# Altium schematic sheet Main.SchDoc
size A4; SheetNumber: 1; SheetTotal: 1; SPICEModelCacheBLOYWJUL: <root> / <DocumentId>BLOYWJUL</DocumentId> / <CacheFrame Number="0"> / <Model Name="0603_885012006004_22pf" Kind="CKT"> / <Text>******* / .subckt 0603_885012006004_22pF 1 2 / Rser 1 3 0.34819611654 / Lser 2 4 7.75018519E-10 / C1 3 4 0.000000000022 / Rpar 3 4 10000000000 / .ends 0603_885012006004_22pF</Text> / </Model> / <Model Name="0603_885382206004_100nf" Kind="CKT"> / <Text>******* / .subckt 0603_885382206004_100nF 1 2 / Rser 1 3 0.105 / Lser 2 4 7.84352286E-10 / C1 3 4 0.0000001 / Rpar 3 4 5000000000 / .ends 0603_885382206004_100nF</Text> / </Model> / <Model Name="0603_885382206002_10nf" Kind="CKT"> / <Text>******* / .subckt 0603_885382206002_10nF 1 2 / Rser 1 3 0.19 / Lser 2 4 8.43227742E-10 / C1 3 4 0.00000001 / Rpar 3 4 10000000000 / .ends 0603_885382206002_10nF</Text> / </Model> / </CacheFrame> / </root>
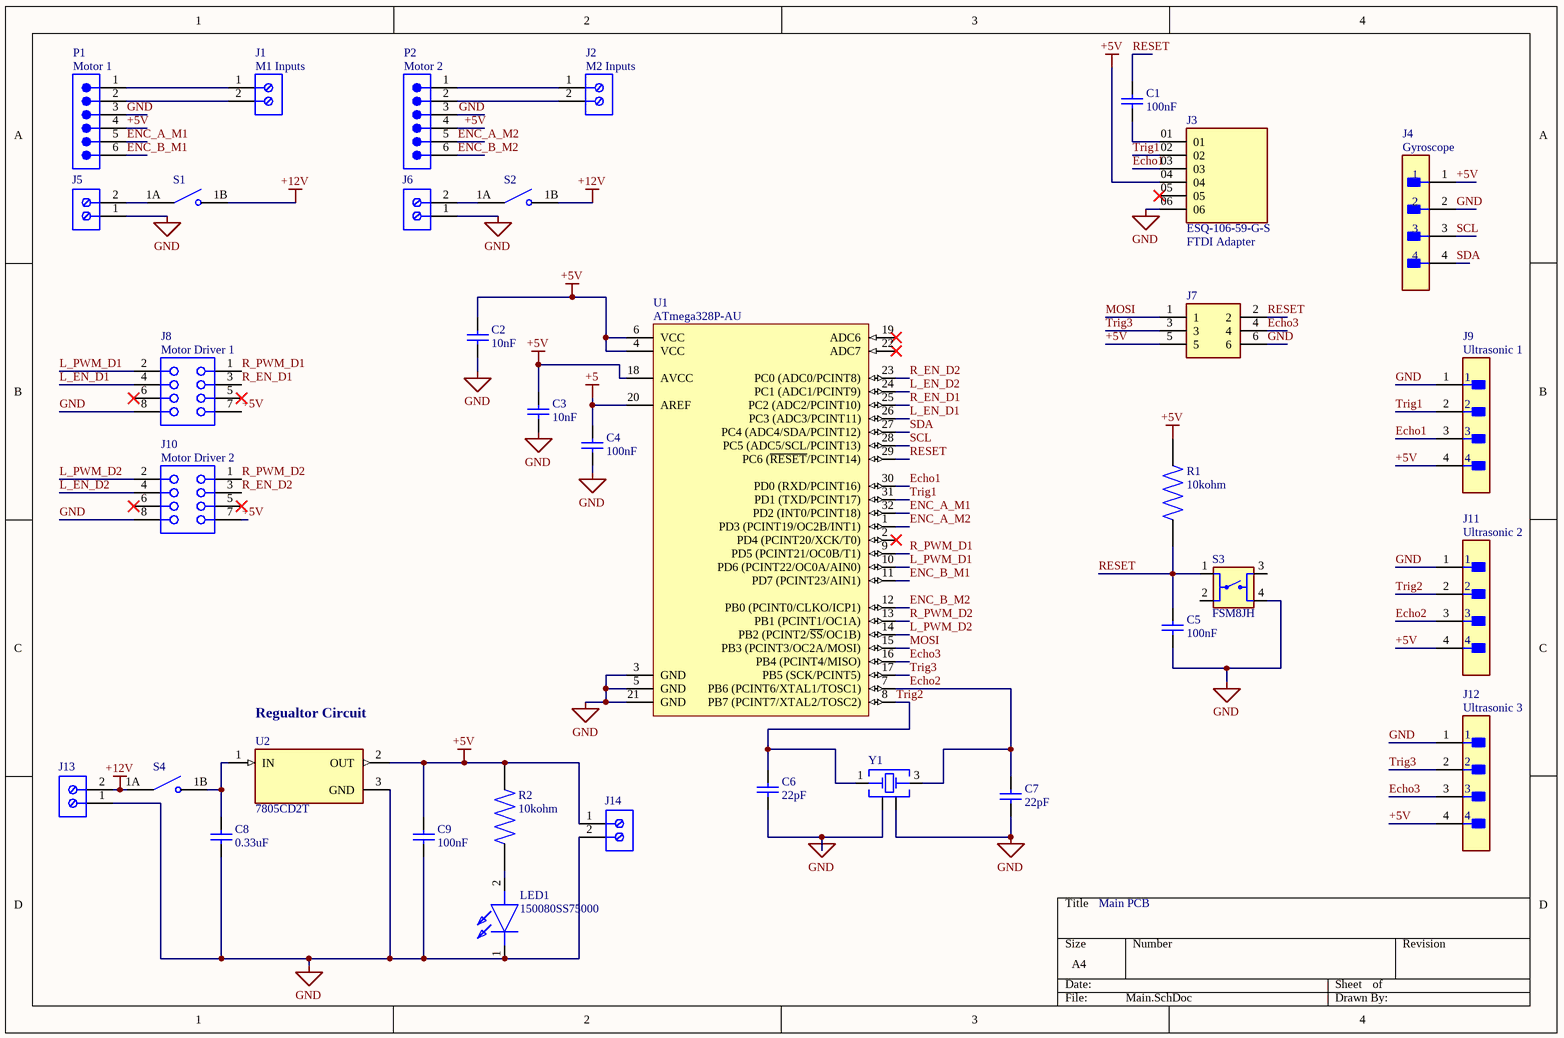
[diagram p0: Main.SchDoc]

## Parts
C1  100nF  [WCAP-CSST_0603_L1.6W0.8H0.8_Reflow]
C2  10nF  [WCAP-CSST_0603_L1.6W0.8H0.8_Reflow]
C3  10nF  [WCAP-CSST_0603_L1.6W0.8H0.8_Reflow]
C4  100nF  [WCAP-CSST_0603_L1.6W0.8H0.8_Reflow]
C5  100nF  [WCAP-CSST_0603_L1.6W0.8H0.8_Reflow]
C6  22pF  [WCAP-CSGP_0603_L1.6W0.8H0.8_Reflow]
C7  22pF  [WCAP-CSGP_0603_L1.6W0.8H0.8_Reflow]
C8  Capacitance: 0.33uF  [WCAP-CSST_0603_L1.6W0.8H0.8_Reflow]  (hidden comment: 100nF)
C9  100nF  [WCAP-CSST_0603_L1.6W0.8H0.8_Reflow]
J1  691137710002  [691137710002]  (value not drawn)
J2  691137710002  [691137710002]  (value not drawn)
J3  ESQ-106-59-G-S  [SAMTEC_ESQ-106-59-G-S]
J4  MPU6050  [FP-M20-9990445-MFG]  (value not drawn)
J5  691137710002  [691137710002]  (value not drawn)
J6  691137710002  [691137710002]  (value not drawn)
J7  20021111-00006T4LF  [2002111100006T4LF]  (value not drawn)
J8  Motor Driver 1  [SMTC-SSW-104-02-X-D]
J9  Ultrasonic 1  [FP-B4B-XH-A_LF_SN-MFG]
J10  Motor Driver 2  [SMTC-SSW-104-02-X-D]
J11  Ultrasonic 2  [FP-B4B-XH-A_LF_SN-MFG]
J12  Ultrasonic 3  [FP-B4B-XH-A_LF_SN-MFG]
J13  691137710002  [691137710002]  (value not drawn)
J14  691137710002  [691137710002]  (value not drawn)
LED1  150080SS75000  [150080SS75000]
P1  Motor 1  [61300611121]
P2  Motor 2  [61300611121]
R1  value 10kohm  [RESC2012X65N]  (hidden comment: RMCF0805FG10K0)
R2  value 10kohm  [RESC2012X65N]  (hidden comment: RMCF0805FG10K0)
S1  DS01-254-L-01BE  [SW_DS01-254-L-01BE]  (value not drawn)
S2  DS01-254-L-01BE  [SW_DS01-254-L-01BE]  (value not drawn)
S3  FSM8JH  [SW_FSM8JH]
S4  DS01-254-L-01BE  [SW_DS01-254-L-01BE]  (value not drawn)
U1  ATmega328P-AU  [32A_M]
U2  7805CD2T  [TO254P1542X460-3N]
Y1  830072604  [WE-XTAL_CFPX-180]  (value not drawn)

## Nets
+5: C4.2 U1.20(AREF)
+5V: C2.2 C3.2 C9.2 J3.04 J4.1 J7.5 J8.7 J9.4 J10.7 J11.4 J12.4 J14.1 P1.4 P2.4 R1.2 R2.2 U1.4(VCC) U1.6(VCC) U1.18(AVCC) U2.2(OUT)
+12V: J13.2 S1.1B(NO1) S2.1B(NO1) S4.1A(COM1)
GND: C2.1 C3.1 C4.1 C5.1 C6.1 C7.1 C8.1 C9.1 J3.06 J4.2 J5.1 J6.1 J7.6 J8.8 J9.1 J10.8 J11.1 J12.1 J13.1 J14.2 LED1.1(K) P1.3 P2.3 S3.4 U1.3(GND) U1.5(GND) U1.21(GND) U2.3(GND) Y1.2(GND&Lid) Y1.4(GND&Lid)
Echo1: J3.03 J9.3 U1.30(PD0_(RXD/PCINT16))
Echo2: C7.2 J11.3 U1.7(PB6_(PCINT6/XTAL1/TOSC1)) Y1.3(Crystal)
Echo3: J7.4 J12.3 U1.16(PB4_(PCINT4/MISO))
ENC_A_M1: P1.5 U1.32(PD2_(INT0/PCINT18))
ENC_A_M2: P2.5 U1.1(PD3_(PCINT19/OC2B/INT1))
ENC_B_M1: P1.6 U1.11(PD7_(PCINT23/AIN1))
ENC_B_M2: P2.6 U1.12(PB0_(PCINT0/CLKO/ICP1))
L_EN_D1: J8.4 U1.26(PC3_(ADC3/PCINT11))
L_EN_D2: J10.4 U1.24(PC1_(ADC1/PCINT9))
L_PWM_D1: J8.2 U1.10(PD6_(PCINT22/OC0A/AIN0))
L_PWM_D2: J10.2 U1.14(PB2_(PCINT2/~{SS}/OC1B))
MOSI: J7.1 U1.15(PB3_(PCINT3/OC2A/MOSI))
R_EN_D1: J8.3 U1.25(PC2_(ADC2/PCINT10))
R_EN_D2: J10.3 U1.23(PC0_(ADC0/PCINT8))
R_PWM_D1: J8.1 U1.9(PD5_(PCINT21/OC0B/T1))
R_PWM_D2: J10.1 U1.13(PB1_(PCINT1/OC1A))
RESET: C1.2 C5.2 J7.2 R1.1 S3.1 U1.29(PC6_(~{RESET}/PCINT14))
SCL: J4.3 U1.28(PC5_(ADC5/SCL/PCINT13))
SDA: J4.4 U1.27(PC4_(ADC4/SDA/PCINT12))
Trig1: J3.02 J9.2 U1.31(PD1_(TXD/PCINT17))
Trig2: C6.2 J11.2 U1.8(PB7_(PCINT7/XTAL2/TOSC2)) Y1.1(Crystal)
Trig3: J7.3 J12.2 U1.17(PB5_(SCK/PCINT5))
NetC1_1: C1.1 J3.01
NetC8_2: C8.2 S4.1B(NO1) U2.1(IN)
NetJ1_1: J1.1 P1.1
NetJ1_2: J1.2 P1.2
NetJ2_1: J2.1 P2.1
NetJ2_2: J2.2 P2.2
NetJ5_2: J5.2 S1.1A(COM1)
NetJ6_2: J6.2 S2.1A(COM1)
NetLED1_2: LED1.2(A) R2.1

Not connected (* = marked no-connect by the designer): J3 05*; J8 5* 6*; J10 5* 6*; S3 2 3; U1 2(PD4_(PCINT20/XCK/T0))* 19(ADC6)* 22(ADC7)*

## Notes on the sheet
- (near J1) M1 Inputs
- (near J2) M2 Inputs
- (near J4) Gyroscope
- (near J3) FTDI Adapter
- (near U2) Regualtor Circuit
- Main PCB

## Library data of the parts
C1 C4 C5 C8 C9 = 885382206004: WCAP-CSST Multilayer Ceramic Chip Capacitor, Soft Termination, size 0603, X7R Class II, 100nF, 50VDC; Manufacturer: Wurth Elektronik; Case/Size Code: 0603; Capacitance Tolerance: +/-10%; Dissipation Factor: 3%; Insulation Resistance: 5GOhm; Rated Voltage (DC): 50V; Technical Reference: X7R0603104K050DFCT1S000; Manufacturer Part Number: 885382206004; Category: Multilayer Ceramic Chip Capacitors; Match Code: WCAP-CSST; ComponentLink1Description: Website Link; ComponentLink1URL: https://www.we-online.com/redexpert/article/885382206004?ad; ComponentLink2Description: Datasheet Link; ComponentLink2URL: https://www.we-online.com/redexpert/spec/885382206004?ad; Mount: Surface Mount; Operating Temperature Max: 125°C; Operating Temperature Min: -55°C; Packaging: Tape and Reel; Length: 1.6mm; Width: 0.8mm; Height: 0.8mm; Ceramic Type: X7R Class II
  C1 C4 C5 C9: Capacitance: 100nF
C2 C3 = 885382206002: WCAP-CSST Multilayer Ceramic Chip Capacitor, Soft Termination, size 0603, X7R Class II, 10nF, 50VDC; Manufacturer: Wurth Elektronik; Case/Size Code: 0603; Capacitance Tolerance: +/-10%; Dissipation Factor: 2.5%; Insulation Resistance: 10GOhm; Rated Voltage (DC): 50V; Technical Reference: X7R0603103K050DFCT1S000; Manufacturer Part Number: 885382206002; Category: Multilayer Ceramic Chip Capacitors; Match Code: WCAP-CSST; ComponentLink1Description: Website Link; ComponentLink1URL: https://www.we-online.com/redexpert/article/885382206002?ad; ComponentLink2Description: Datasheet Link; ComponentLink2URL: https://www.we-online.com/redexpert/spec/885382206002?ad; Mount: Surface Mount; Operating Temperature Max: 125°C; Operating Temperature Min: -55°C; Packaging: Tape and Reel; Length: 1.6mm; Width: 0.8mm; Height: 0.8mm; Capacitance: 10nF; Ceramic Type: X7R Class II
C6 C7 = 885012006004: WCAP-CSGP Multilayer Ceramic Chip Capacitor, General Purpose, size 0603, NP0, 22pF, 10VDC; Manufacturer: Wurth Elektronik; Case/Size Code: 0603; Capacitance Tolerance: +/-5%; Insulation Resistance: 10GOhm; Q Factor: 840; Rated Voltage (DC): 10V; Technical Reference: NP00603220J010DFCT10000; Manufacturer Part Number: 885012006004; Category: Multilayer Ceramic Chip Capacitors; Match Code: WCAP-CSGP; ComponentLink1Description: Website Link; ComponentLink1URL: https://www.we-online.com/redexpert/article/885012006004?ad; ComponentLink2Description: Datasheet Link; ComponentLink2URL: https://www.we-online.com/redexpert/spec/885012006004?ad; Mount: Surface Mount; Operating Temperature Max: 125°C; Operating Temperature Min: -55°C; Packaging: Tape and Reel; Length: 1.6mm; Width: 0.8mm; Height: 0.8mm; Capacitance: 22pF; Ceramic Type: NP0
J1 J2 J5 J6 J13 J14 = CMP-1502-03324-2: NexarPartId: 78871135; Voltage Rating: 300V; Number of Contacts: 2; Current Rating: 16A; Lead Pitch: 5mm; Height: 11.6mm; Packaging: Box; RoHS: Non-Compliant; Contact Material: Nickel, Tin; Max Operating Temperature: 120°C; Number of Pins: 2; Min Operating Temperature: -30°C; Number of Rows: 1
J4 = CMP-00671-05399696-1: M20-9990445 Conn Unshrouded Header HDR 4 POS 2.54mm Solder ST Thru-Hole Bulk/Loose; Insulation Resistance: 10GΩ; Connector Type: Male Pin; Voltage Rating (DC): 750V; Max Current Rating: 3A; Contact Resistance: 25mΩ; Number of Contacts: 4; Gender: Male; Color: Black; Height: 2.54mm; Contact Material: Brass, Bronze, Gold, Nickel; Orientation: Straight; Width: 12.7mm; Mount: Through Hole; Pitch: 2.54mm; Lead Pitch: 2.54mm; RoHS: Compliant; Max Operating Temperature: 105°C; Case/Package: SIL; NexarPartId: 5399696; Depth: 2.54mm; Length: 10.16mm; Current Rating: 3A; Contact Plating: Gold; Radiation Hardening: No; Contact Mating Length: 6.096mm; Voltage Rating (AC): 750V; Termination: Solder; REACH SVHC: No SVHC; Weight: 45.359237g; Number of Rows: 1; Min Operating Temperature: -40°C; Housing Material: Nylon; Housing Color: Black; Number of Positions: 4; Number of Pins: 4
J7 = 20021111-00006T4LF: Connector; Manufacturer_Name: Amphenol Communications Solutions; Datasheet Link: https://cdn.amphenol-cs.com/media/wysiwyg/files/drawing/20021111.pdf; Height: 5mm; Manufacturer_Part_Number: 20021111-00006T4LF; Arrow Part Number: 20021111-00006T4LF; Arrow Price/Stock: https://www.arrow.com/en/products/20021111-00006t4lf/amphenol-fci?region=europe
J8 J10 = CMP-1023-00343-1: SQ Post Socket, Through-hole, Vertical, -55 to 125 degC, 2.54mm Pitch, 8-Pin, Female, RoHS; Manufacturer: Samtec; PartNumber: SSW-104-02-G-D; Mounting Technology: Through-hole; ComponentLink1Description: Manufacturer URL; Orientation: Vertical; Pitch: 2.54 mm; ComponentLink2URL: http://www.samtec.com/documents/webfiles/pdf/SSW_TH.PDF; PackageReference: SSW-104-02-X-D; ComponentLink3Description: Package Specification; PackageVersion: CA, 6/1987; PackageDescription: Assembly, Socket Strip .016 X .031 Tail; ComponentLink2Description: Datasheet; RoHS: True; ComponentLink1URL: http://www.samtec.com; ComponentLink3URL: http://www.samtec.com/documents/webfiles/cpdf/SSW-1XX-XX-XXX-X-XX-XXX-XX-MKT.pdf; DatasheetVersion: F-214; Temperature Range: -55 to 125 degC
J9 J11 J12 = CMP-17439-000250-1: CONN HEADER VERT 4POS 2.5MM; Number of Contacts: 4; Contact Resistance: 20mR; Voltage Rating: 250V; Max Current Rating: 3A; Gender: Male; Wire/Cable Gauge: 22AWG; Mated Stacking Heights: 9.8mm; Insulation Resistance: 1GR; Orientation: Straight; Contact Type: Male Pin; Contact Finish - Mating: TIN; Series: XH; Max Voltage Rating (AC): 250V; Lead Pitch: 2.5mm; Contact Shape: Square; Insulation Color: Natural; Termination: Solder; Lead Free: Lead Free; Voltage Rating (AC): 250V; Number of Rows: 1; Flammability Rating: UL94 V-0; Number of Positions: 4; Max Operating Temperature: 85°C; Package Quantity: 500; Mount: Through Hole; REACH SVHC: No SVHC; Connector Type: Header; Insulation Material: Nylon; Fastening Type: Detent; Min Operating Temperature: -25°C; Housing Color: White; Packaging: Bulk; Contact Plating: Tin; Contact Material: Brass; Max Voltage Rating (DC): 250V; Housing Material: Polyamide; Color: Natural; Material: Polyamide; Pitch: 2.5mm; Depth: 5.75mm; Current Rating: 3A; Length: 12.4mm
LED1 = 150080SS75000: LED; Manufacturer_Name: Wurth Elektronik; Datasheet Link: https://www.we-online.com/components/products/datasheet/150080SS75000.pdf; Height: 0.8mm; Manufacturer_Part_Number: 150080SS75000; Mouser Part Number: 710-150080SS75000; Mouser Price/Stock: https://www.mouser.co.uk/ProductDetail/Wurth-Elektronik/150080SS75000?qs=LlUlMxKIyB2zzpiaOzrUdw%3D%3D
P1 P2 = CMP-1502-01070-3: NexarPartId: 20084590; Current Rating: 3A; Pitch: 2.54mm; Gender: Male; Operating Supply Voltage: 250V; Connector Type: Male Pin; Number of Positions: 6; Contact Resistance: 20mΩ; Packaging: Bulk; Number of Pins: 6; Number of Rows: 1; Contact Plating: Gold; Lead Free: Lead Free; RoHS: Compliant; Contact Mating Length: 5.9944mm; Voltage Rating: 250V; REACH SVHC: Unknown; Contact Gender: Male; Housing Material: PBT; Min Operating Temperature: -40°C; Lead Pitch: 2.54mm; Mount: Through Hole; Number of Contacts: 6; Max Operating Temperature: 105°C; Contact Material: Copper; Orientation: Vertical; Termination: Through Hole; Color: Black; Height: 8.89mm
S1 S2 S4 = DS01-254-L-01BE: 1 Position, Through Hole, 2.54 mm Pitch, Raised Slide Actuator, Flat Bottom, Long Pin, DIP Switch; MF: CUI Devices; Check_prices: https://www.snapeda.com/parts/DS01-254-L-01BE/CUI+Devices/view-part/?ref=eda; CUI_purchase_URL: https://www.cuidevices.com/product/switches/dip-switches/ds01-254-series?utm_source=snapeda.com&utm_medium=referral&utm_campaign=snapedaBOM; Package: None; Purchase-URL: https://pricing.snapeda.com/search/part/DS01-254-L-01BE/?ref=eda; MP: DS01-254-L-01BE; Value: *; SnapEDA_Link: https://www.snapeda.com/parts/DS01-254-L-01BE/CUI+Devices/view-part/?ref=snap; Availability: In Stock; Price: None
S3 = FSM8JH: Tactile Switch SPST-NO Top Actuated Through Hole; MF: TE Connectivity; Check_prices: https://www.snapeda.com/parts/FSM8JH/TE+Connectivity+ALCOSWITCH+Switches/view-part/?ref=eda; Value: *; Availability: In Stock; MP: FSM8JH; Price: None; Package: None; SnapEDA_Link: https://www.snapeda.com/parts/FSM8JH/TE+Connectivity+ALCOSWITCH+Switches/view-part/?ref=snap
U1 = CMP-0095-00269-2: 8-bit AVR Microcontroller, 32KB Flash, 1KB EEPROM, 2KB SRAM, 32-pin TQFP, Industrial Grade (-40°C to 85°C); PackageDescription: 32-Lead, 7x7x1.0 mm Body, 0.8mm Lead Pitch, Thin Profile Plastic Quad Flat Package (TQFP); DatasheetVersion: revD, May-2011; RevisionNote: DatasheetVersion & PackageVersion updated. URLs added.; ComponentLink1URL: http://www.atmel.com/; ComponentLink2Description: ATmega48A/48PA/88A/88PA/168A/168PA/328/328P Datasheet; Code_JEDEC: MS-026-ABA; ComponentLink1Description: Manufacturer URL; PackageReference: 32A; ComponentLink3Description: ATmega48A/48PA/88A/88PA/168A/168PA/328/328P Summary; ComponentLink2URL: http://www.atmel.com/dyn/resources/prod_documents/doc8271.pdf; PackageVersion: revC, Oct-2010; ComponentLink3URL: http://www.atmel.com/dyn/resources/prod_documents/8271S.pdf
U2 = 7805CD2T: Linear Voltage Regulator IC Positive Fixed 1 Output 1.5A D2PAK; MF: STMicroelectronics; SnapEDA_Link: https://www.snapeda.com/parts/7805CD2T/STMicroelectronics/view-part/?ref=snap; Package: D2PAK STMicroelectronics; Value: *; MP: 7805CD2T; Check_prices: https://www.snapeda.com/parts/7805CD2T/STMicroelectronics/view-part/?ref=eda
Y1 = CMP-03913-116876517-1: 830072604 WE-XTAL Quartz Crystal; Frequency: 25MHz; Length: 3.2mm; Min Operating Temperature: -40°C; NexarPartId: 116876517; Height: 800µm; Width: 2.5mm; Max Operating Temperature: 85°C
J3 = ESQ-106-59-G-S: Value: *; Price: None; Availability: Unavailable; Package: None; MP: ESQ-106-59-G-S
R1 R2 = RMCF0805FG10K0: Package: None; Price: None; MP: RMCF0805FG10K0; Availability: Unavailable